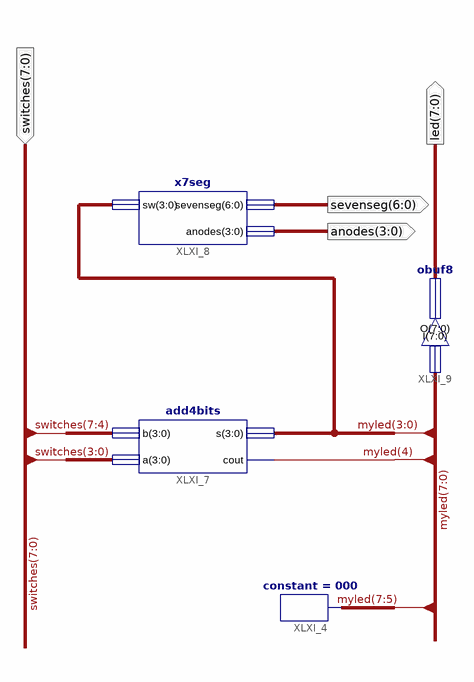
[diagram p0: schematic sheet 1]
// Xilinx ISE schematic toplevel.sch (spartan3e) as structural Verilog: 4 symbols, 4 ports
module toplevel (
  input  [7:0] switches,
  output [7:0] led,
  output [6:0] sevenseg,
  output [3:0] anodes
);

  wire [7:0] myled;

  constant #(.CValue("000")) XLXI_4 (.O(myled[7:5]));
  add4bits XLXI_7 (.b(switches[7:4]), .a(switches[3:0]), .s(myled[3:0]), .cout(myled[4]));
  x7seg XLXI_8 (.sw(myled[3:0]), .sevenseg(sevenseg), .anodes(anodes));
  obuf8 XLXI_9 (.I(myled), .O(led));
endmodule
